# EAGLE design Computer Power Relay - Power Strip (EAGLE 9.6.2)
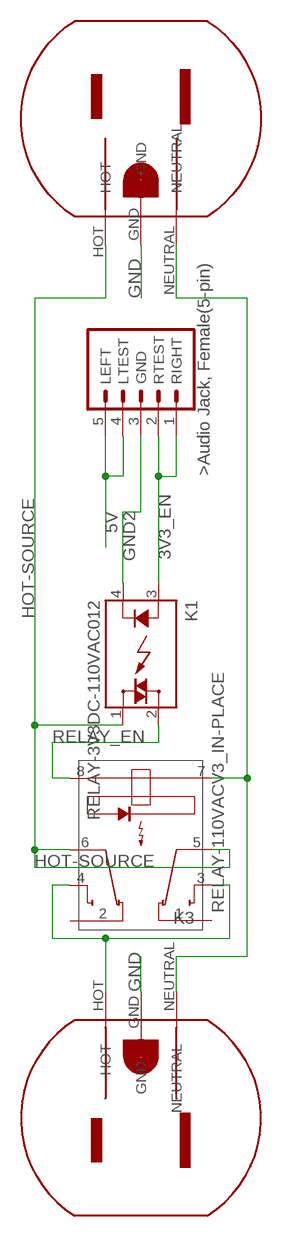
[diagram p0: schematic, sheet 1]

## Parts
K1  RELAY-3V3DC-110VAC012  [RELAY-3V3-110V]
K3  RELAY-110VACV3_IN-PLACE  [RELAY-110VAC-V3]
U$1  AUDIO_JACK_FEMALE_5-PIN  [AUDIO_JACK_FEMALE_5-PIN]
U$2  MAINS-POWER-OUTLET3-PIN  [3-PIN-POWER]
U$3  MAINS-POWER-OUTLET3-PIN  [3-PIN-POWER]

## Nets
3V3_EN: K1.3 U$1.1(RIGHT) U$1.2(RTEST)
5V: U$1.4(LTEST) U$1.5(LEFT)
GND: U$2.GND U$3.GND
GND2: K1.4 U$1.3(GND)
HOT-SOURCE: K1.1 K3.5 K3.6 U$3.HOT
N$1: K3.3 K3.4 U$2.HOT
N$2: K3.7 U$2.NEUTRAL U$3.NEUTRAL
RELAY_EN: K1.2 K3.8
Unconnected: K3.1 K3.2

## Library data of the parts
K1 = Inventory:RELAY-3V3DC-110VAC: AUTOMOTIVE LOW PROFILE MICRO-280 RELAY NAiS Source: http://www.mew-europe.com/.. en_ds_61214_0000.pdf; MPN: ACV33012; OC_FARNELL: unknown; OC_NEWARK: 39M3505
K3 = Inventory:RELAY-110VAC: SOLID STATE RELAY NAiS Source: http://www.mew-europe.com/.. en_ds_61606_0000.pdf
U$1 = Inventory:AUDIO_JACK_FEMALE_5-PIN
U$2 U$3 = Inventory:MAINS-POWER-OUTLET

## Net classes
0 default: clearance 0.205 mm

## Board
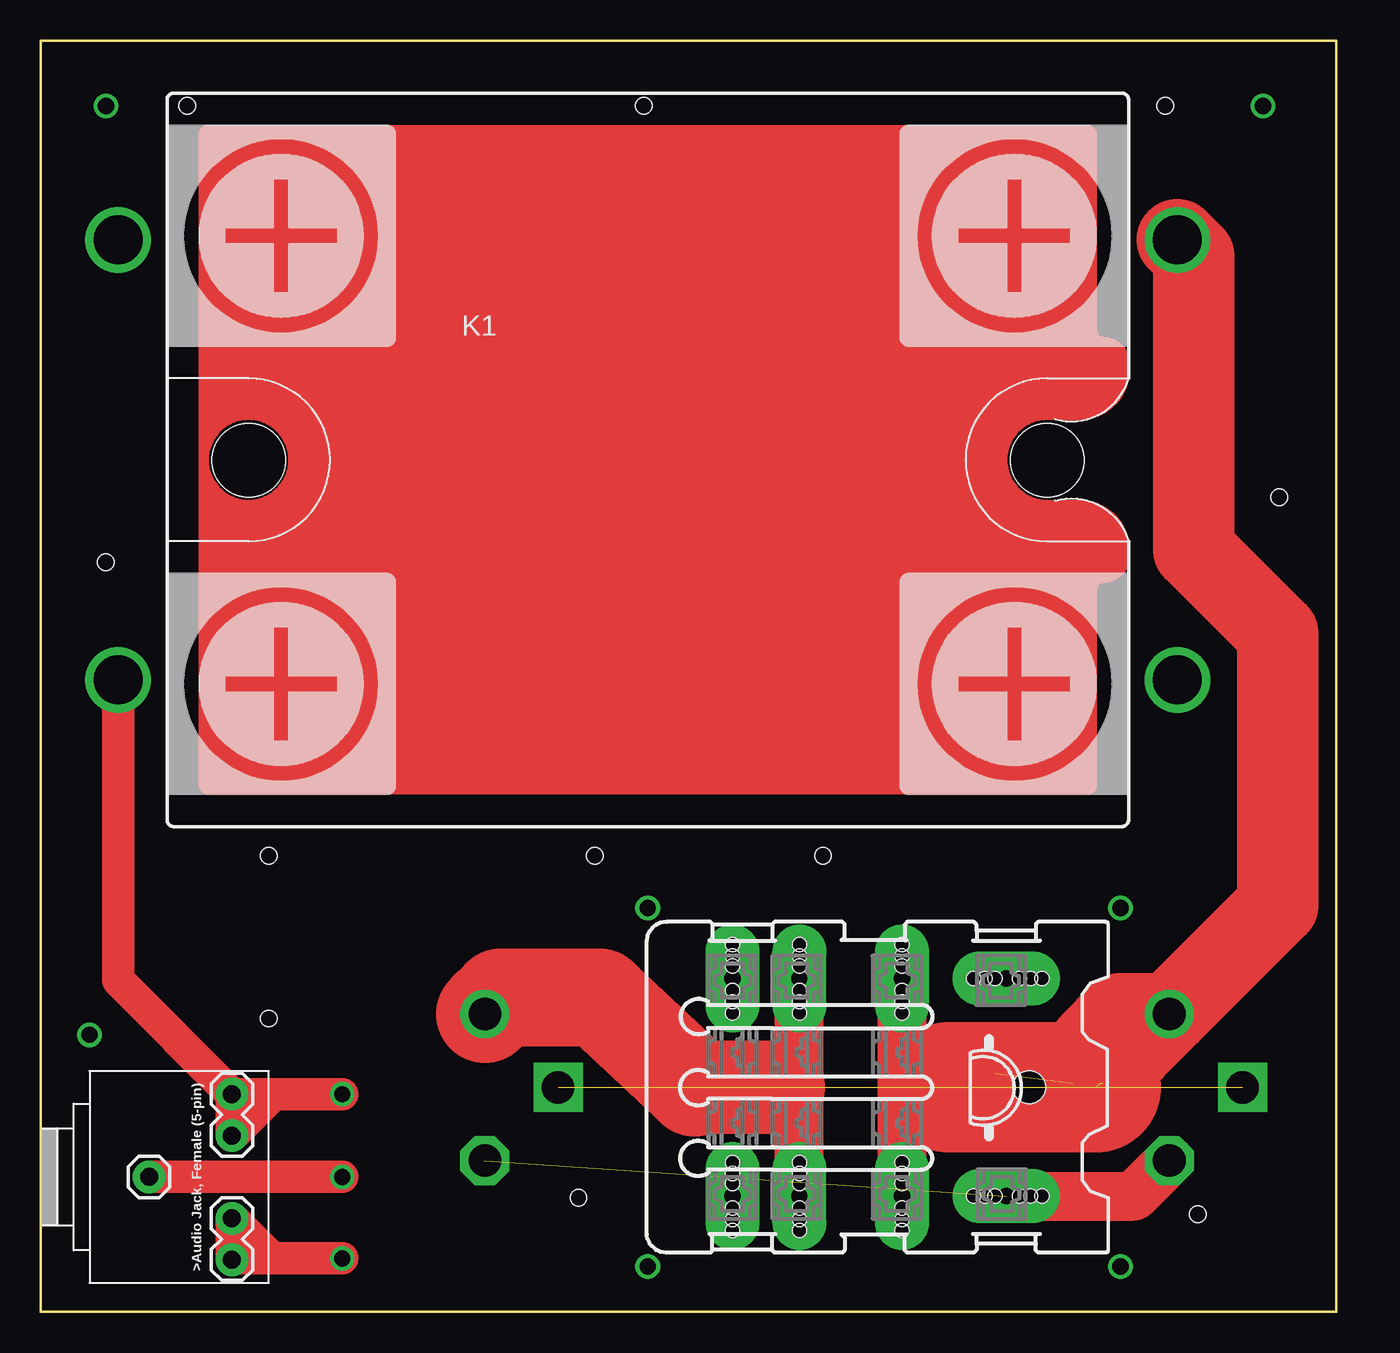
[diagram p1: board, top side]
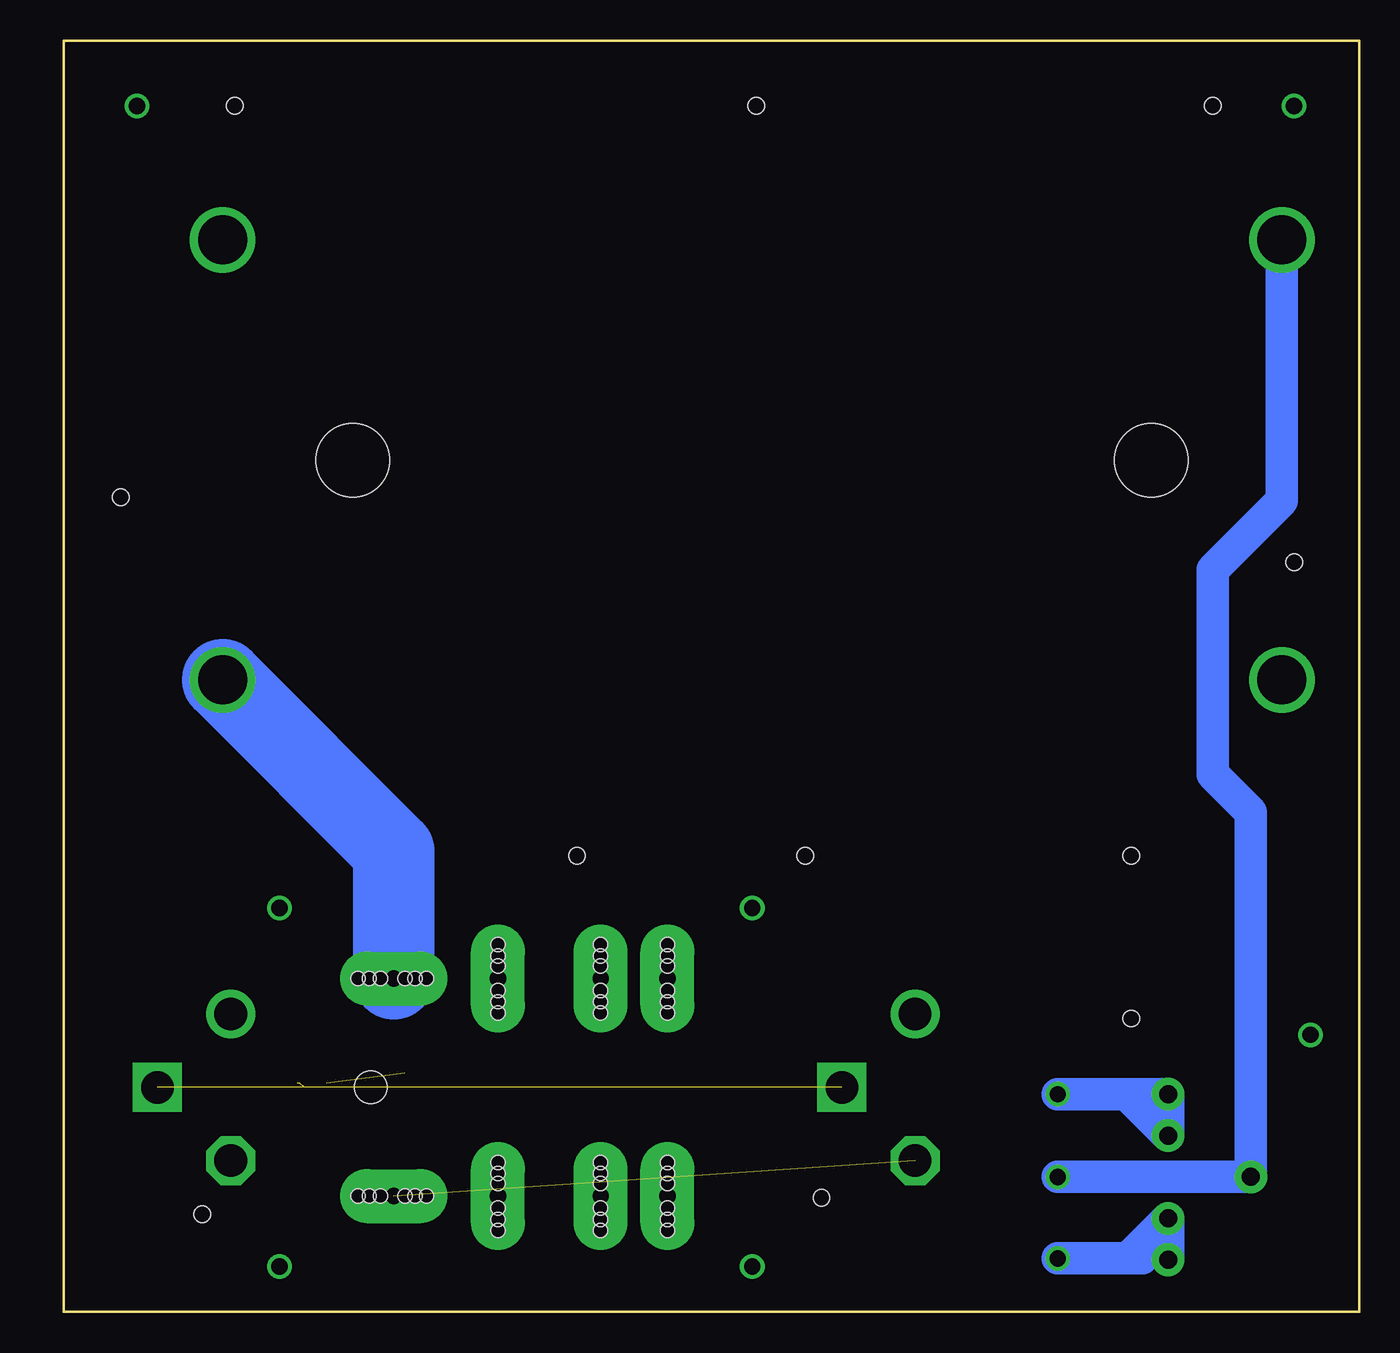
[diagram p2: board, bottom side, seen from below]

Size 79.5 x 78 mm. Coordinates in mm from the lower left corner, seen from the top.
Outline: 0,0 0,78 79.5,78 79.5,0 0,0
Copper layers (1*16): Top 0.035mm / dielectric 1.5mm / Bottom 0.035mm
Design rules "default": minimum track width 6mil, minimum drill 0.35mm, track to track 6mil, track to pad 6mil, pad to pad 6mil, via to via 6mil, smd to smd 6mil, copper to edge 40mil, drill to drill 6mil, minimum pad ring 10mil, minimum via ring 8mil, stop-mask expansion 4mil, vias tented up to drill 0mil, thermal gap 10mil
Holes 4.5 mm at 12.75,52.25 61.75,52.25
Holes 1 mm at 48,28 34,28 14,28 33,7 71,6 14,18 69,74 37,74 9,74 4,46 76,50

### Footprints (pad centres in the part's own frame; a part is rotated, then mirrored left to right if it is on the bottom)
RELAY-3V3-110V = drill 3: 1 -13.5,32.5; 2 13.5,32.5; 3 13.5,-32.5; 4 -13.5,-32.5
RELAY-110VAC-V3 = drill 1 pad 3.302 long: 1 -6.675,16.8; 2 6.675,16.8; 3 -6.675,12.7; 4 6.675,12.7; 5 -6.675,6.4; 6 6.675,6.4; 7 -6.675,0; 8 6.675,0 | drill 1: P$1 11,22; P$2 -11,22; P$3 -11,-7; P$4 11,-7 | hole 2: 0,-1.4 | hole 0.85: -7.4,16.8; -8.8,16.8; -8.1,16.8; -4.6,16.8; -5.3,16.8; -5.9,16.8; -7.4,12.7; -8.8,12.7; -8.1,12.7; -4.6,12.7; -5.3,12.7; -5.9,12.7; -7.4,6.4; -8.8,6.4; -8.1,6.4; -4.6,6.4; -5.3,6.4; -5.9,6.4; -6.675,-0.8; -6.675,-2.2; -6.675,-1.5; -6.675,2; -6.675,1.3; -6.675,0.7; 5.95,16.8; 4.55,16.8; 5.25,16.8; 8.75,16.8; 8.05,16.8; 7.45,16.8; 5.95,12.7; 4.55,12.7; 5.25,12.7; 8.75,12.7; 8.05,12.7; 7.45,12.7; 5.95,6.4; 4.55,6.4; 5.25,6.4; 8.75,6.4; 8.05,6.4; 7.45,6.4; 6.675,-0.8; 6.675,-2.2; 6.675,-1.5; 6.675,2; 6.675,1.3; 6.675,0.7
AUDIO_JACK_FEMALE_5-PIN = drill 1.1 pad 2: 1 -5.08,2.73; 2 -2.54,2.73; 3 0,-2.35; 4 2.54,2.73; 5 5.08,2.73
3-PIN-POWER = drill 2 square: GND 0,4.5 | drill 2: HOT -4.5,0 | drill 2 octagon: NEUTRAL 4.5,0

### Placement (x,y rotation side)
K1  37.25,52.28 270 top
K3  59.25,13.78 90 top
U$1  9,8.28 270 top
U$2  27.25,13.78 270 top
U$3  69.25,13.78 270 top

### Tracks (layer width: path | path; a pad name or v marks a point on that pad's centre or on a via)
3V3_EN  (via drill 1)
  Top 2: U$1.1 U$1.2 14.27,13.36 | 14.27,13.36 v18.5,13.36 | U$1.1 14.27,13.36 | U$1.1 4.75,20.34 K1.3
  Bottom 2: 14.27,13.36 U$1.2 U$1.1 14.27,13.36 | 14.27,13.36 v18.5,13.36
5V  (via drill 1)
  Top 2: 14.19,3.28 11.81,3.28 U$1.5 U$1.4 14.19,3.28 | v18.5,3.28 14.19,3.28
  Bottom 2: 11.81,3.28 U$1.5 U$1.4 14.19,3.28 | 13.31,3.28 14.19,3.28 | v18.5,3.28 14.19,3.28
GND  (1 unrouted)
GND2  (via drill 1)
  Top 2: v18.5,8.28 U$1.3
  Bottom 2: v18.5,8.28 U$1.3 6.65,30.65 9,33 9,45.53 4.75,49.78 K1.4
HOT-SOURCE  (3 unrouted)
  Top 0.152: 52.85,8.38 K3.5 | 58.25,13.78 58.56,14.09 58.56,14.65 | 63.36,14.03 65,14.03
  Top 3: K3.5 52.85,14.28 | 52.85,14.28 K3.6 | 55.75,13.78 55.25,14.28 52.85,14.28
  Top 5: U$3.HOT 65.17,14.2 65.17,14.03 | U$3.HOT 66.25,18.28 64.39,16.42 | U$3.HOT 75.91,24.94 75.91,41.62 70.75,46.78 70.75,64.78 K1.1
  Top 8: 55.75,13.78 64.75,13.78
N$1
  Top 3: K3.3 46.55,13.78 | 46.55,13.78 K3.4 | 46.55,13.78 45.25,13.78
  Top 5.75: 45.25,13.78 40.12,13.78
  Top 6: U$2.HOT 28.25,19.28 34.28,19.28 40.12,13.78
N$2  (1 unrouted)
  Top 3: K3.7 67.08,7.11 U$3.NEUTRAL
N$3  (via drill 1)
  other vias: 4,74
N$4  (via drill 1)
  other vias: 75,74
N$5  (via drill 1)
  other vias: 3,17
RELAY_EN
  Bottom 5: K3.8 59.25,28.28 K1.2

### Text on the board
tValues: 3V3_EN | GND | 5V